# Altium schematic sheet IQ解调器原理图.SchDoc
size A3
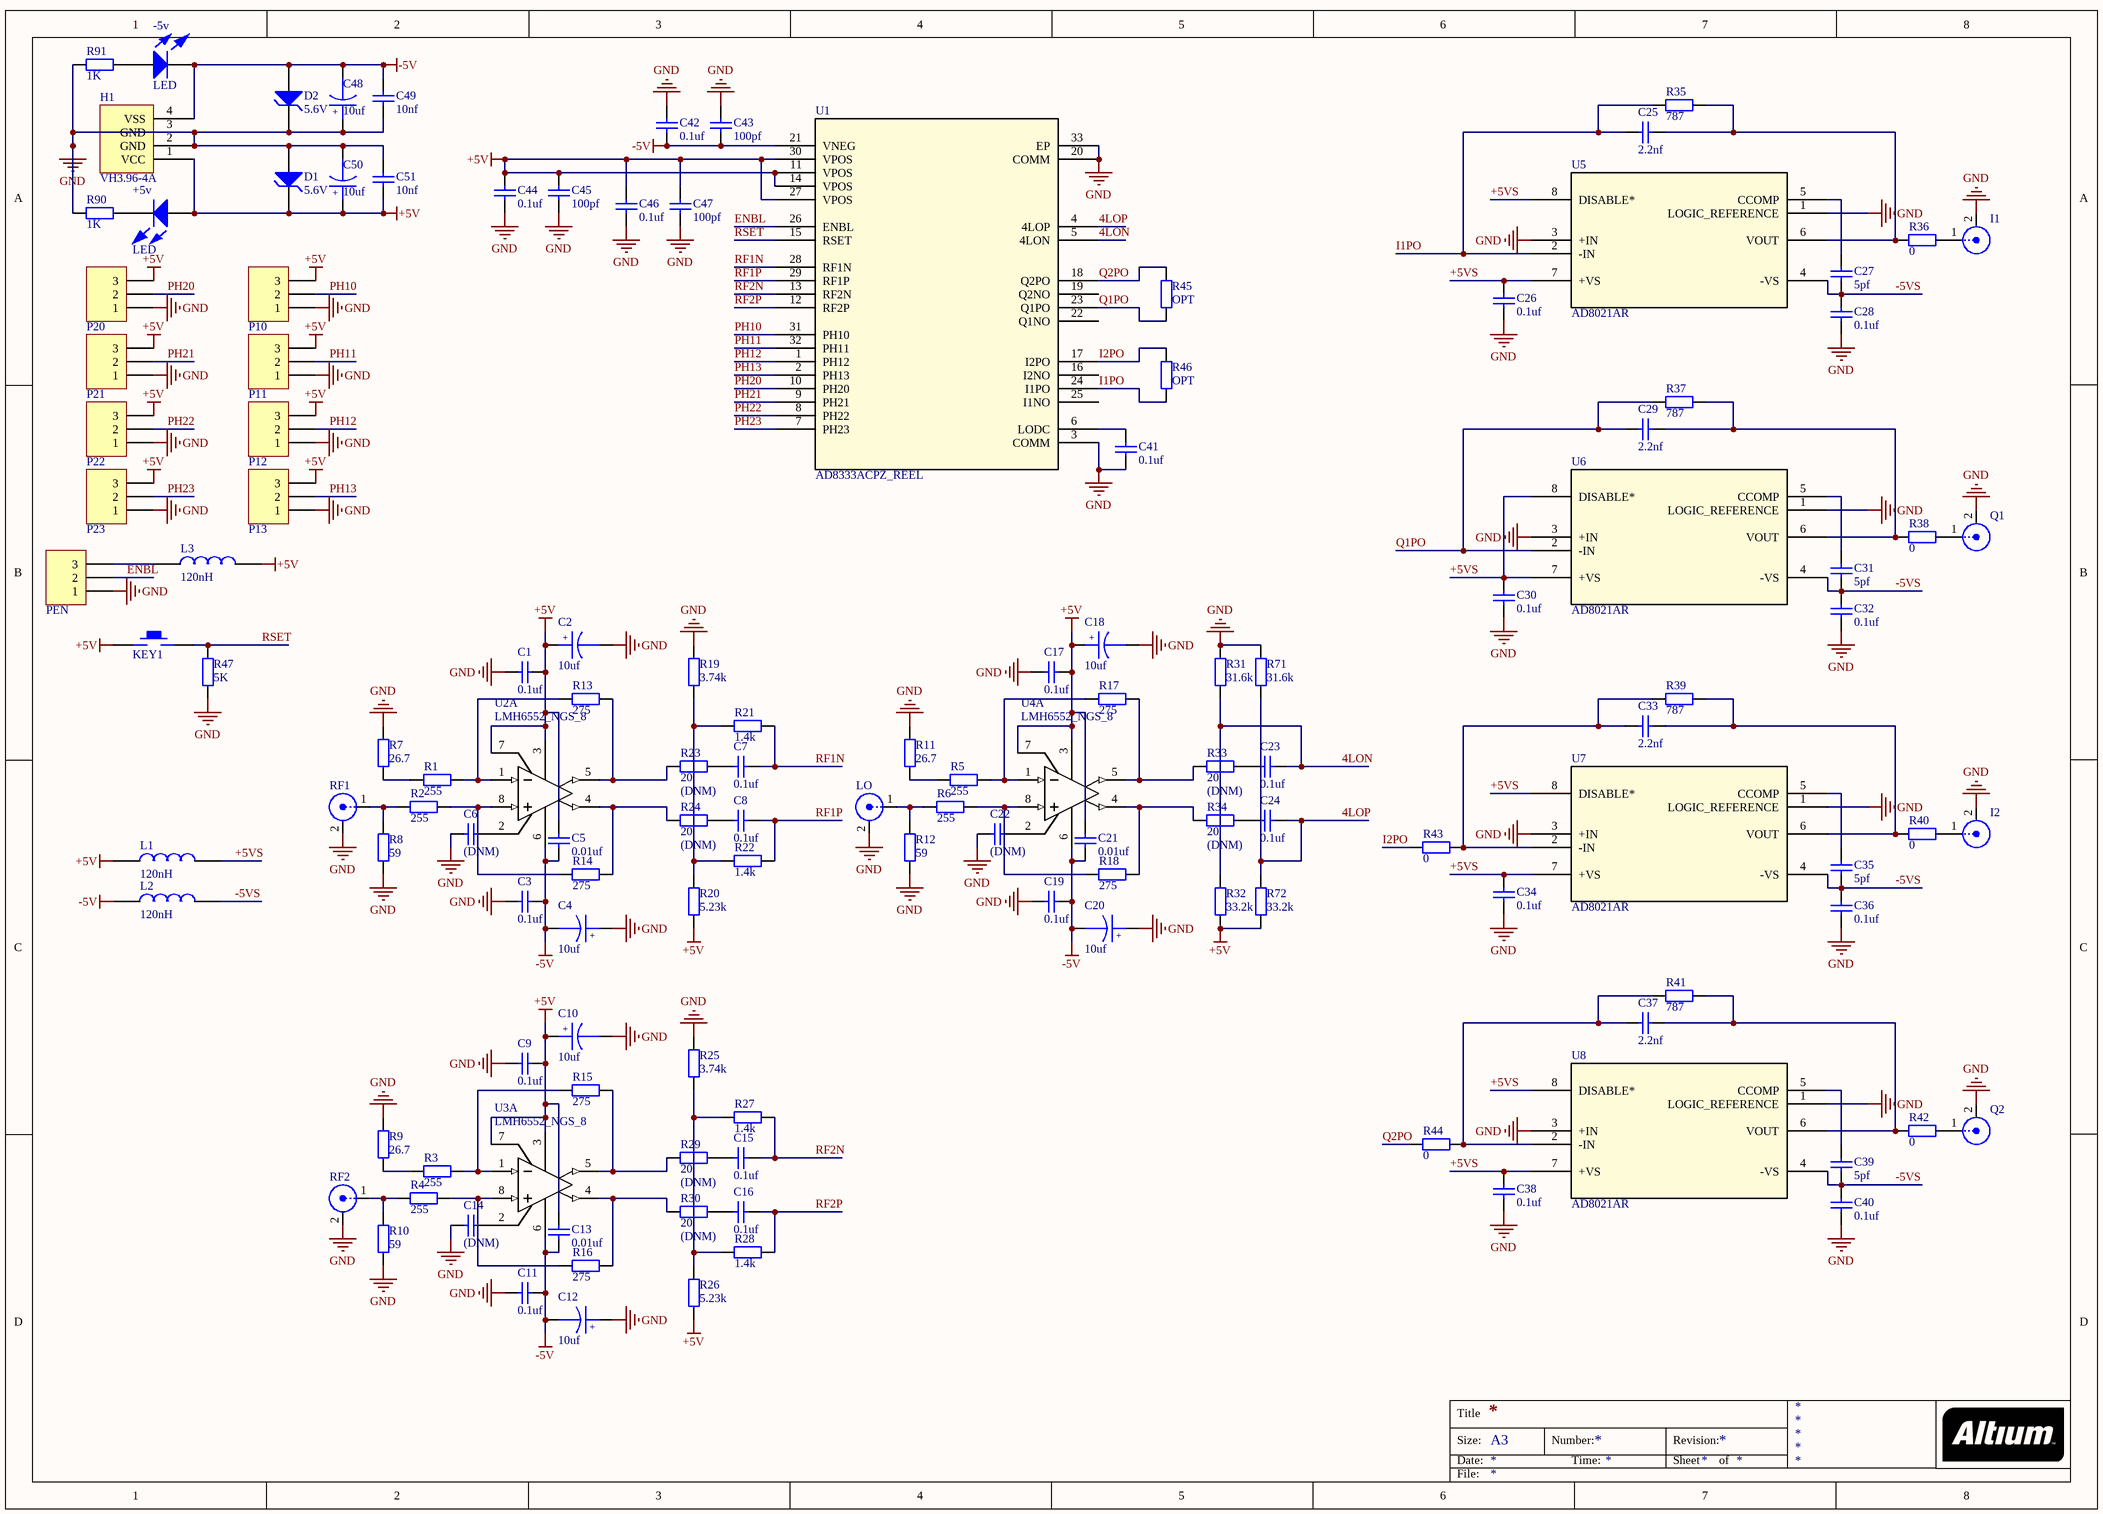
[diagram p0: IQ解调器原理图.SchDoc]

## Parts
+5v  LED  [0805]
-5v  LED  [0805]
C1  value 0.1uf  [0603C]  (hidden comment: Cap)
C2  10uf  [3216C-TYPE_A]
C3  value 0.1uf  [0603C]  (hidden comment: Cap)
C4  10uf  [3216C-TYPE_A]
C5  value 0.01uf  [0603C]  (hidden comment: Cap)
C6  value (DNM)  [0603C]  (hidden comment: Cap)
C7  value 0.1uf  [0603C]  (hidden comment: Cap)
C8  value 0.1uf  [0603C]  (hidden comment: Cap)
C9  value 0.1uf  [0603C]  (hidden comment: Cap)
C10  10uf  [3216C-TYPE_A]
C11  value 0.1uf  [0603C]  (hidden comment: Cap)
C12  10uf  [3216C-TYPE_A]
C13  value 0.01uf  [0603C]  (hidden comment: Cap)
C14  value (DNM)  [0603C]  (hidden comment: Cap)
C15  value 0.1uf  [0603C]  (hidden comment: Cap)
C16  value 0.1uf  [0603C]  (hidden comment: Cap)
C17  value 0.1uf  [0603C]  (hidden comment: Cap)
C18  10uf  [3216C-TYPE_A]
C19  value 0.1uf  [0603C]  (hidden comment: Cap)
C20  10uf  [3216C-TYPE_A]
C21  value 0.01uf  [0603C]  (hidden comment: Cap)
C22  value (DNM)  [0603C]  (hidden comment: Cap)
C23  value 0.1uf  [0603C]  (hidden comment: Cap)
C24  value 0.1uf  [0603C]  (hidden comment: Cap)
C25  value 2.2nf  [0603C]  (hidden comment: Cap)
C26  value 0.1uf  [0603C]  (hidden comment: Cap)
C27  value 5pf  [0603C]  (hidden comment: Cap)
C28  value 0.1uf  [0603C]  (hidden comment: Cap)
C29  value 2.2nf  [0603C]  (hidden comment: Cap)
C30  value 0.1uf  [0603C]  (hidden comment: Cap)
C31  value 5pf  [0603C]  (hidden comment: Cap)
C32  value 0.1uf  [0603C]  (hidden comment: Cap)
C33  value 2.2nf  [0603C]  (hidden comment: Cap)
C34  value 0.1uf  [0603C]  (hidden comment: Cap)
C35  value 5pf  [0603C]  (hidden comment: Cap)
C36  value 0.1uf  [0603C]  (hidden comment: Cap)
C37  value 2.2nf  [0603C]  (hidden comment: Cap)
C38  value 0.1uf  [0603C]  (hidden comment: Cap)
C39  value 5pf  [0603C]  (hidden comment: Cap)
C40  value 0.1uf  [0603C]  (hidden comment: Cap)
C41  value 0.1uf  [0603C]  (hidden comment: Cap)
C42  value 0.1uf  [0603C]  (hidden comment: Cap)
C43  value 100pf  [0603C]  (hidden comment: Cap)
C44  value 0.1uf  [0603C]  (hidden comment: Cap)
C45  value 100pf  [0603C]  (hidden comment: Cap)
C46  value 0.1uf  [0603C]  (hidden comment: Cap)
C47  value 100pf  [0603C]  (hidden comment: Cap)
C48  10uf  [3216C-TYPE_A]
C49  value 10nf  [0603C]  (hidden comment: Cap)
C50  10uf  [3216C-TYPE_A]
C51  value 10nf  [0603C]  (hidden comment: Cap)
D1  5.6V  [SMA/DO-214AC]
D2  5.6V  [SMA/DO-214AC]
H1  VH3.96-4A  [VH3.96-4P]
I1  SMA  [SMA-2]  (value not drawn)
I2  SMA  [SMA-2]  (value not drawn)
KEY1  KEY_M  [KEY_M]  (value not drawn)
L1  120nH  [0603R]
L2  120nH  [0603R]
L3  120nH  [0603R]
LO  SMA  [SMA-2]  (value not drawn)
P10  Header 3  [HDR3X1_A]  (value not drawn)
P11  Header 3  [HDR3X1_A]  (value not drawn)
P12  Header 3  [HDR3X1_A]  (value not drawn)
P13  Header 3  [HDR3X1_A]  (value not drawn)
P20  Header 3  [HDR3X1_A]  (value not drawn)
P21  Header 3  [HDR3X1_A]  (value not drawn)
P22  Header 3  [HDR3X1_A]  (value not drawn)
P23  Header 3  [HDR3X1_A]  (value not drawn)
PEN  Header 3  [HDR3X1_A]  (value not drawn)
Q1  SMA  [SMA-2]  (value not drawn)
Q2  SMA  [SMA-2]  (value not drawn)
R1  value 255  [0603R]  (hidden comment: Res1)
R2  value 255  [0603R]  (hidden comment: Res1)
R3  value 255  [0603R]  (hidden comment: Res1)
R4  value 255  [0603R]  (hidden comment: Res1)
R5  value 255  [0603R]  (hidden comment: Res1)
R6  value 255  [0603R]  (hidden comment: Res1)
R7  value 26.7  [0603R]  (hidden comment: Res1)
R8  value 59  [0603R]  (hidden comment: Res1)
R9  value 26.7  [0603R]  (hidden comment: Res1)
R10  value 59  [0603R]  (hidden comment: Res1)
R11  value 26.7  [0603R]  (hidden comment: Res1)
R12  value 59  [0603R]  (hidden comment: Res1)
R13  value 275  [0603R]  (hidden comment: Res1)
R14  value 275  [0603R]  (hidden comment: Res1)
R15  value 275  [0603R]  (hidden comment: Res1)
R16  value 275  [0603R]  (hidden comment: Res1)
R17  value 275  [0603R]  (hidden comment: Res1)
R18  value 275  [0603R]  (hidden comment: Res1)
R19  value 3.74k  [0603R]  (hidden comment: Res1)
R20  value 5.23k  [0603R]  (hidden comment: Res1)
R21  value 1.4k  [0603R]  (hidden comment: Res1)
R22  value 1.4k  [0603R]  (hidden comment: Res1)
R23  (DNM)  value 20  [0603R]
R24  (DNM)  value 20  [0603R]
R25  value 3.74k  [0603R]  (hidden comment: Res1)
R26  value 5.23k  [0603R]  (hidden comment: Res1)
R27  value 1.4k  [0603R]  (hidden comment: Res1)
R28  value 1.4k  [0603R]  (hidden comment: Res1)
R29  (DNM)  value 20  [0603R]
R30  (DNM)  value 20  [0603R]
R31  value 31.6k  [0603R]  (hidden comment: Res1)
R32  value 33.2k  [0603R]  (hidden comment: Res1)
R33  (DNM)  value 20  [0603R]
R34  (DNM)  value 20  [0603R]
R35  value 787  [0603R]  (hidden comment: Res1)
R36  value 0  [0603R]  (hidden comment: Res1)
R37  value 787  [0603R]  (hidden comment: Res1)
R38  value 0  [0603R]  (hidden comment: Res1)
R39  value 787  [0603R]  (hidden comment: Res1)
R40  value 0  [0603R]  (hidden comment: Res1)
R41  value 787  [0603R]  (hidden comment: Res1)
R42  value 0  [0603R]  (hidden comment: Res1)
R43  value 0  [0603R]  (hidden comment: Res1)
R44  value 0  [0603R]  (hidden comment: Res1)
R45  value OPT  [0603R]  (hidden comment: Res1)
R46  value OPT  [0603R]  (hidden comment: Res1)
R47  value 5K  [0603R]  (hidden comment: Res1)
R71  value 31.6k  [0603R]  (hidden comment: Res1)
R72  value 33.2k  [0603R]  (hidden comment: Res1)
R90  value 1K  [0603R]  (hidden comment: Res1)
R91  value 1K  [0603R]  (hidden comment: Res1)
RF1  SMA  [SMA-2]  (value not drawn)
RF2  SMA  [SMA-2]  (value not drawn)
U1  AD8333ACPZ_REEL  [CP_32_2]
U2  LMH6552_NGS_8  [LC-SOIC-8_150mil]  (part A of 2)
U3  LMH6552_NGS_8  [LC-SOIC-8_150mil]  (part A of 2)
U4  LMH6552_NGS_8  [LC-SOIC-8_150mil]  (part A of 2)
U5  AD8021AR  [R_8]
U6  AD8021AR  [R_8]
U7  AD8021AR  [R_8]
U8  AD8021AR  [R_8]

## Nets
+5V: +5v.1(A) C1.2 C2.1 C5.2 C9.2 C10.1 C13.2 C17.2 C18.1 C21.2 C44.2 C45.2 C46.2 C47.2 C50.1 C51.1 D1.2(K) H1.1(VCC) KEY1.1 L1.1 L3.2 P10.3 P11.3 P12.3 P13.3 P20.3 P21.3 P22.3 P23.3 R20.1 R26.1 R32.1 R72.1 U1.11(VPOS) U1.14(VPOS) U1.27(VPOS) U1.30(VPOS) U2.3(V+) U2.7(EN) U3.3(V+) U3.7(EN) U4.3(V+) U4.7(EN)
-5V: -5v.2(K) C3.1 C4.2 C5.1 C11.1 C12.2 C13.1 C19.1 C20.2 C21.1 C42.1 C43.1 C48.2 C49.2 D2.1(A) H1.4(VSS) L2.1 U1.21(VNEG) U2.6(V-) U3.6(V-) U4.6(V-)
GND: C1.1 C2.2 C3.2 C4.1 C6.1 C9.1 C10.2 C11.2 C12.1 C14.1 C17.1 C18.2 C19.2 C20.1 C22.1 C26.1 C28.1 C30.1 C32.1 C34.1 C36.1 C38.1 C40.1 C41.1 C42.2 C43.2 C44.1 C45.1 C46.1 C47.1 C48.1 C49.1 C50.2 C51.2 D1.1(A) D2.2(K) H1.2(GND) H1.3(GND) I1.2(GND) I2.2(GND) LO.2(GND) P10.1 P11.1 P12.1 P13.1 P20.1 P21.1 P22.1 P23.1 PEN.1 Q1.2(GND) Q2.2(GND) R7.2 R8.1 R9.2 R10.1 R11.2 R12.1 R19.2 R25.2 R31.2 R47.1 R71.2 R90.1 R91.1 RF1.2(GND) RF2.2(GND) U1.3(COMM) U1.20(COMM) U1.33(EP) U5.1(LOGIC_REFERENCE) U5.3(+IN) U6.1(LOGIC_REFERENCE) U6.3(+IN) U7.1(LOGIC_REFERENCE) U7.3(+IN) U8.1(LOGIC_REFERENCE) U8.3(+IN)
4LON: C23.2 R31.1 R32.2 U1.5(4LON)
4LOP: C24.2 R71.1 R72.2 U1.4(4LOP)
+5VS: C26.2 C30.2 C34.2 C38.2 L1.2 U5.7(+VS) U5.8(DISABLE*) U6.7(+VS) U6.8(DISABLE*) U7.7(+VS) U7.8(DISABLE*) U8.7(+VS) U8.8(DISABLE*)
-5VS: C27.2 C28.2 C31.2 C32.2 C35.2 C36.2 C39.2 C40.2 L2.2 U5.4(-VS) U6.4(-VS) U7.4(-VS) U8.4(-VS)
ENBL: PEN.2 U1.26(ENBL)
I1PO: C25.1 R35.1 R46.1 U1.24(I1PO) U5.2(-IN)
I2PO: R43.1 R46.2 U1.17(I2PO)
PH10: P10.2 U1.31(PH10)
PH11: P11.2 U1.32(PH11)
PH12: P12.2 U1.1(PH12)
PH13: P13.2 U1.2(PH13)
PH20: P20.2 U1.10(PH20)
PH21: P21.2 U1.9(PH21)
PH22: P22.2 U1.8(PH22)
PH23: P23.2 U1.7(PH23)
Q1PO: C29.1 R37.1 R45.1 U1.23(Q1PO) U6.2(-IN)
Q2PO: R44.1 R45.2 U1.18(Q2PO)
RF1N: C7.2 R21.1 U1.28(RF1N)
RF1P: C8.2 R22.2 U1.29(RF1P)
RF2N: C15.2 R27.1 U1.13(RF2N)
RF2P: C16.2 R28.2 U1.12(RF2P)
RSET: KEY1.2 R47.2 U1.15(RSET)
Net+5v_2: +5v.2(K) R90.2
Net-5v_1: -5v.1(A) R91.2
NetC6_2: C6.2 U2.2(VCM)
NetC7_1: C7.1 R23.2
NetC8_1: C8.1 R24.2
NetC14_2: C14.2 U3.2(VCM)
NetC15_1: C15.1 R29.2
NetC16_1: C16.1 R30.2
NetC22_2: C22.2 U4.2(VCM)
NetC23_1: C23.1 R33.2
NetC24_1: C24.1 R34.2
NetC25_2: C25.2 R35.2 R36.1 U5.6(VOUT)
NetC27_1: C27.1 U5.5(CCOMP)
NetC29_2: C29.2 R37.2 R38.1 U6.6(VOUT)
NetC31_1: C31.1 U6.5(CCOMP)
NetC33_1: C33.1 R39.1 R43.2 U7.2(-IN)
NetC33_2: C33.2 R39.2 R40.1 U7.6(VOUT)
NetC35_1: C35.1 U7.5(CCOMP)
NetC37_1: C37.1 R41.1 R44.2 U8.2(-IN)
NetC37_2: C37.2 R41.2 R42.1 U8.6(VOUT)
NetC39_1: C39.1 U8.5(CCOMP)
NetC41_2: C41.2 U1.6(LODC)
NetI1_1: I1.1(Signal) R36.2
NetI2_1: I2.1(Signal) R40.2
NetL3_1: L3.1 PEN.3
NetLO_1: LO.1(Signal) R6.1 R12.2
NetQ1_1: Q1.1(Signal) R38.2
NetQ2_1: Q2.1(Signal) R42.2
NetR1_1: R1.1 R7.1
NetR1_2: R1.2 R13.1 U2.1(IN-)
NetR2_1: R2.1 R8.2 RF1.1(Signal)
NetR2_2: R2.2 R14.1 U2.8(IN+)
NetR3_1: R3.1 R9.1
NetR3_2: R3.2 R15.1 U3.1(IN-)
NetR4_1: R4.1 R10.2 RF2.1(Signal)
NetR4_2: R4.2 R16.1 U3.8(IN+)
NetR5_1: R5.1 R11.1
NetR5_2: R5.2 R17.1 U4.1(IN-)
NetR6_2: R6.2 R18.1 U4.8(IN+)
NetR13_2: R13.2 R23.1 U2.5(OUT-)
NetR14_2: R14.2 R24.1 U2.4(OUT+)
NetR15_2: R15.2 R29.1 U3.5(OUT-)
NetR16_2: R16.2 R30.1 U3.4(OUT+)
NetR17_2: R17.2 R33.1 U4.5(OUT-)
NetR18_2: R18.2 R34.1 U4.4(OUT+)
NetR19_1: R19.1 R20.2 R21.2 R22.1
NetR25_1: R25.1 R26.2 R27.2 R28.1

Not connected (* = marked no-connect by the designer): U1 16(I2NO) 19(Q2NO) 22(Q1NO) 25(I1NO)

## Notes on the sheet
- Title
- Size:
- Date:
- A3
- Number:
- Time:
- Revision:
- Sheet
- of
- File:
- (in symbol 钽电容Type-A) +

## Library data of the parts
C1 C3 C5-C9 C11 C13-C17 C19 C21-C47 C49 C51 = Cap: 无极性电容; Published: 8-Jun-2000; LatestRevisionDate: 17-Jul-2002; LatestRevisionNote: Re-released for DXP Platform.; PackageReference: RAD-0.3
  C1 C3 C5-C9 C11 C13-C17 C19 C21-C47 C51: Publisher: Altium Limited
C2 C4 C10 C12 C18 C20 C48 C50 = 钽电容Type-A
D1 D2 = 肖特基-5.6V
I1 I2 LO Q1 Q2 RF1 RF2 = SMA-2
L1-L3 = 0603电感
P10-P13 P20-P23 PEN = Header 3: 接插件; LatestRevisionDate: 17-Jul-2002; LatestRevisionNote: Re-released for DXP Platform.; Publisher: Altium Limited
R1-R47 R71 R72 R90 R91 = Res1: 贴片电阻; Published: 8-Jun-2000; LatestRevisionDate: 17-Jul-2002; LatestRevisionNote: Re-released for DXP Platform.; PackageReference: AXIAL-0.4; Publisher: Altium Limited
U1 = AD8333ACPZ_REEL: Imported; Value: Value; Type: Type; RefDes: RefDes
U2-U4 = LMH6552_NGS_8: Imported; PartNumber: LMH6552SD; Manufacturer: NationalSemiconductor; CompType: Amplifiers; PackageTopMarking: XYTT6552; ComponentLink1DescBC: LMH6552Datasheet; ComponentLink2DescA4: LMH6552WebPage; ComponentLink3DescAC: SDA08CPackagePage; Published: 4-Dec-2008; LatestRevisionDate: 13-Jan-2009; LatestRevisionNote: SimModelAdded; DatasheetVersion: Sep-2007; PackageVersion: revAJan-2004; PackageReference: SDA08C; Publisher: AltiumLimited; PackageDescription: LLPPlasticDual25x30x08mmBody8Lead05mmPitchNoPullback; RoHS: Y; PinCount: 8; DigiKeyPartNumber: LMH6552SDEVAL-ND; ComponentLink1URL: http//wwwnationalcom/ds/LM/LMH6552pdf; ComponentLink2URL: http//wwwnationalcom/pf/LM/LMH6552html; ComponentLink3URL: http//wwwnationalcom/packaging/folders/sda08chtml; Value: Value
U5-U8 = AD8021AR: Imported; Manufacturer_Part_Number: AD8021AR; Vendor: Vendor; Value: Value; Type: Type; RefDes: Refdes